# Altium schematic sheet Sheet1.SchDoc
size A4
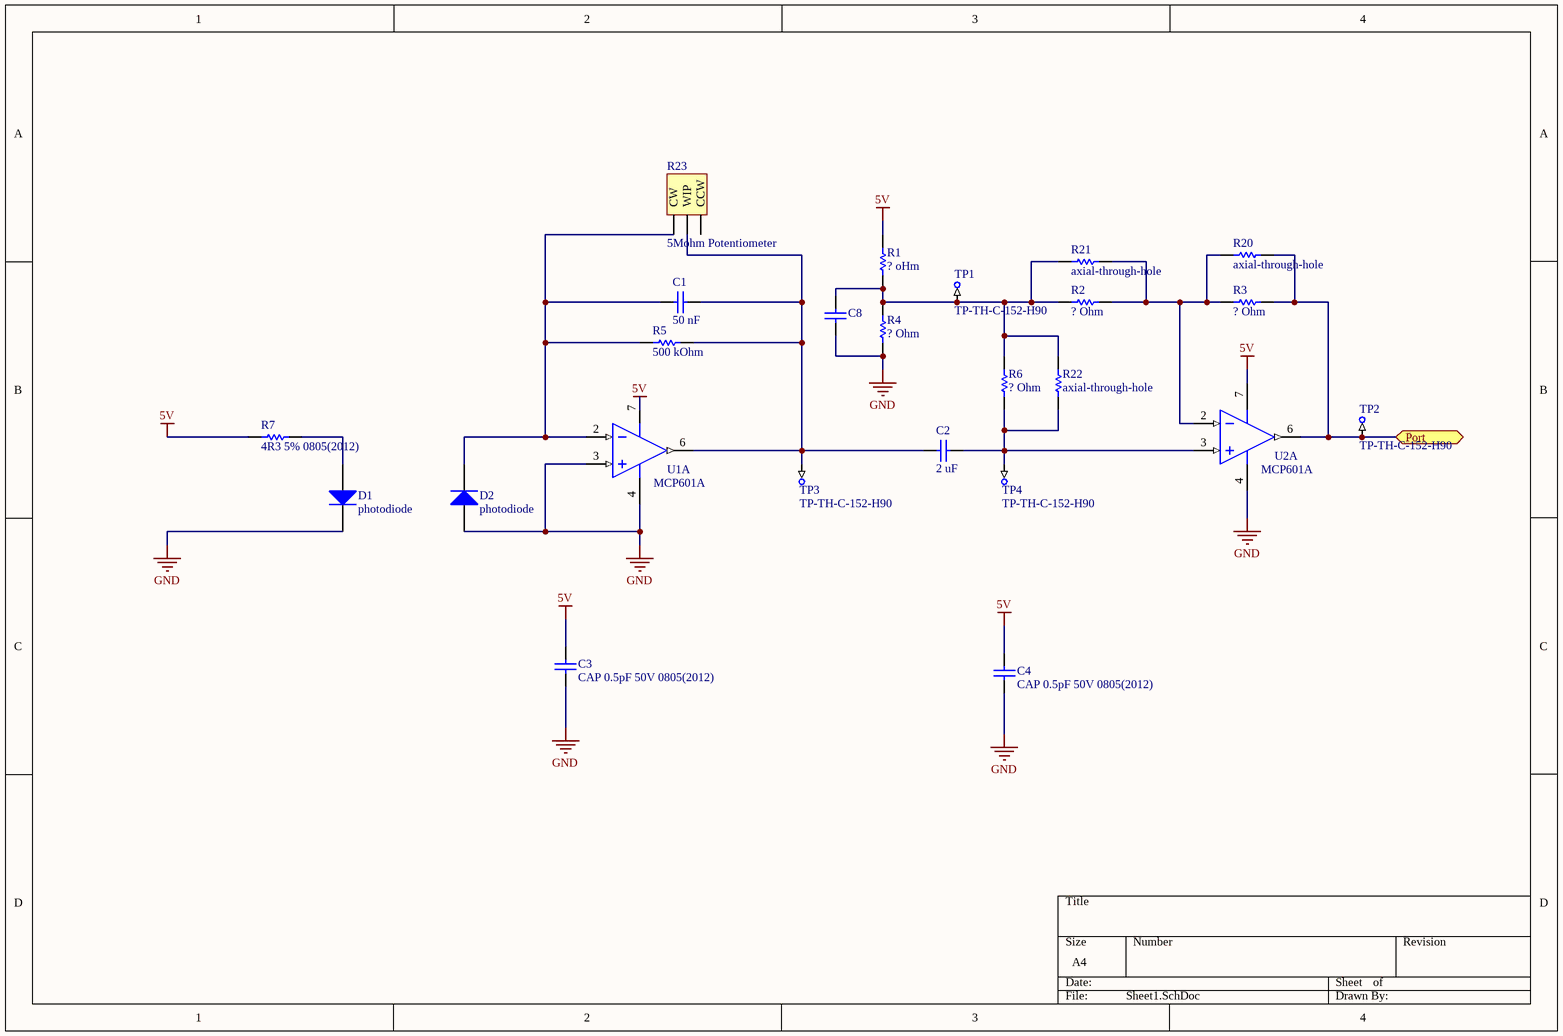
[diagram p0: Sheet1.SchDoc]

## Parts
C1  50 nF  [CAPC0805(2012)75_M]
C2  2 uF  [CAPC0805(2012)75_M]
C3  CAP 0.5pF 50V 0805(2012)  [CAPC0805(2012)75_M]
C4  CAP 0.5pF 50V 0805(2012)  [CAPC0805(2012)75_M]
C8  CAP 0.5pF 50V 0805(2012)  [CAPC0805(2012)75_M]  (value not drawn)
D1  photodiode  [3mm_diode]
D2  photodiode  [3mm_diode]
R1  ? oHm  [RESC0805(2012)_M]
R2  ? Ohm  [RESC0805(2012)_M]
R3  ? Ohm  [RESC0805(2012)_M]
R4  ? Ohm  [RESC0805(2012)_M]
R5  500 kOhm  [RESC0805(2012)_M]
R6  ? Ohm  [RESC0805(2012)_M]
R7  4R3 5% 0805(2012)  [RESC0805(2012)_M]
R20  axial-through-hole  [Axial_resistor]
R21  axial-through-hole  [Axial_resistor]
R22  axial-through-hole  [Axial_resistor]
R23  5Mohm Potentiometer  [5k_pot]
TP1  TP-TH-C-152-H90  [TP-TH-C-152-H90]  (no BOM)
TP2  TP-TH-C-152-H90  [TP-TH-C-152-H90]  (no BOM)
TP3  TP-TH-C-152-H90  [TP-TH-C-152-H90]  (no BOM)
TP4  TP-TH-C-152-H90  [TP-TH-C-152-H90]  (no BOM)
U1  MCP601A  [ADI-Q-8]  (part A of 2)
U2  MCP601A  [ADI-Q-8]  (part A of 2)

## Ports
Port

## Nets
5V: C3.2 C4.2 R1.2 R7.2 U1.7(+V) U2.7(+V)
GND: C3.1 C4.1 C8.1 D1.2(K) D2.1(A) R4.1 U1.3(+IN) U1.4(-V) U2.4(-V)
Port: R3.2 R20.2 TP2.1 U2.6(OUT) ; port Port
NetC1_1: C1.1 C2.2 R5.2 R23.2(WIP) TP3.1 U1.6(OUT)
NetC1_2: C1.2 D2.2(K) R5.1 R23.1(CW) U1.2(-IN)
NetC2_1: C2.1 R6.1 R22.1 TP4.1 U2.3(+IN)
NetC8_2: C8.2 R1.1 R2.1 R4.2 R6.2 R21.1 R22.2 TP1.1
NetD1_1: D1.1(A) R7.1
NetR2_2: R2.2 R3.1 R20.1 R21.2 U2.2(-IN)

Not connected (* = marked no-connect by the designer): R23 3(CCW)

## Library data of the parts
C1-C4 C8 = CMP-1036-00018-1: CAP 0.5pF 50V ±0.1pF 0805 (2012 Metric) Thickness 0.75mm SMD; Case-EIA: 0805; Case-Metric: 2012; Tolerance: Â±0.1pF; Value: 0.5pF; Technology: SMT; Rated Voltage: 50 V; Max Thickness: 0.75 mm
R1-R7 = CMP-1013-00017-1: 4R3 0.125W 5% 0805 (2012 Metric)  SMD; Value: 4.30 Ohm; Case-Metric: 2012; Case-EIA: 0805; Tolerance: 5 %; Power: 0.125 W; Technology: SMT
R20-R22 = axial-through-hole: through-hole
R23 = 5Mohm Potentiometer: 3296W-1-505LF; Manufacturer PN: 3296W-1-505LF
TP1-TP4 = CMP-0484-00003-2: Test Point, Through Hole, Hole Size 0.9 mm, PCB Mount with Silkscreen Box; Manufacturer: No Vendor; PartNumber: TP-TH-C-152-H90
U1 U2 = CMP-0384-00317-1: Single Channel Low Power Operational Amplifier, 880 MHz BW, 1 KV/us SR, Military, 8-pin DIP (Q-8), Tube; Manufacturer: Analog Devices; PartNumber: 5962-9459301MPA; Generic Part Number: AD8001; Input Offset Voltage: 2mV; Small Signal Bandwidth: 880MHz; Slew Rate: 1KV/us; Input Bias Current: 3uA; Iq/Amp: 5mA; Amplifiers Per Package: 1; V Span Max: 12V; V Span Min: 6V; DatasheetVersion: Rev. D; PackageReference: Q-8; PackageDescription: 8-Pin Ceramic Dual In-Line Package, Row spacing 7.62 mm, Pitch 2.54 mm; Mounting Technology: Through Hole; ComponentLink1URL: http://www.analog.com/en/index.html; ComponentLink2Description: Datasheet; ComponentLink3URL: http://www.analog.com/static/imported-files/packages/3925655241313314758Q_8.pdf; ComponentLink1Description: Manufacturer URL; ComponentLink2URL: http://www.analog.com/static/imported-files/data_sheets/AD8001.pdf; ComponentLink3Description: Package Specification; PartId: 1
D1 D2 = photodiode: partnumber: *